# Altium schematic sheet Gate Driver.SchDoc
size B; SheetNumber: 1; SheetTotal: 1
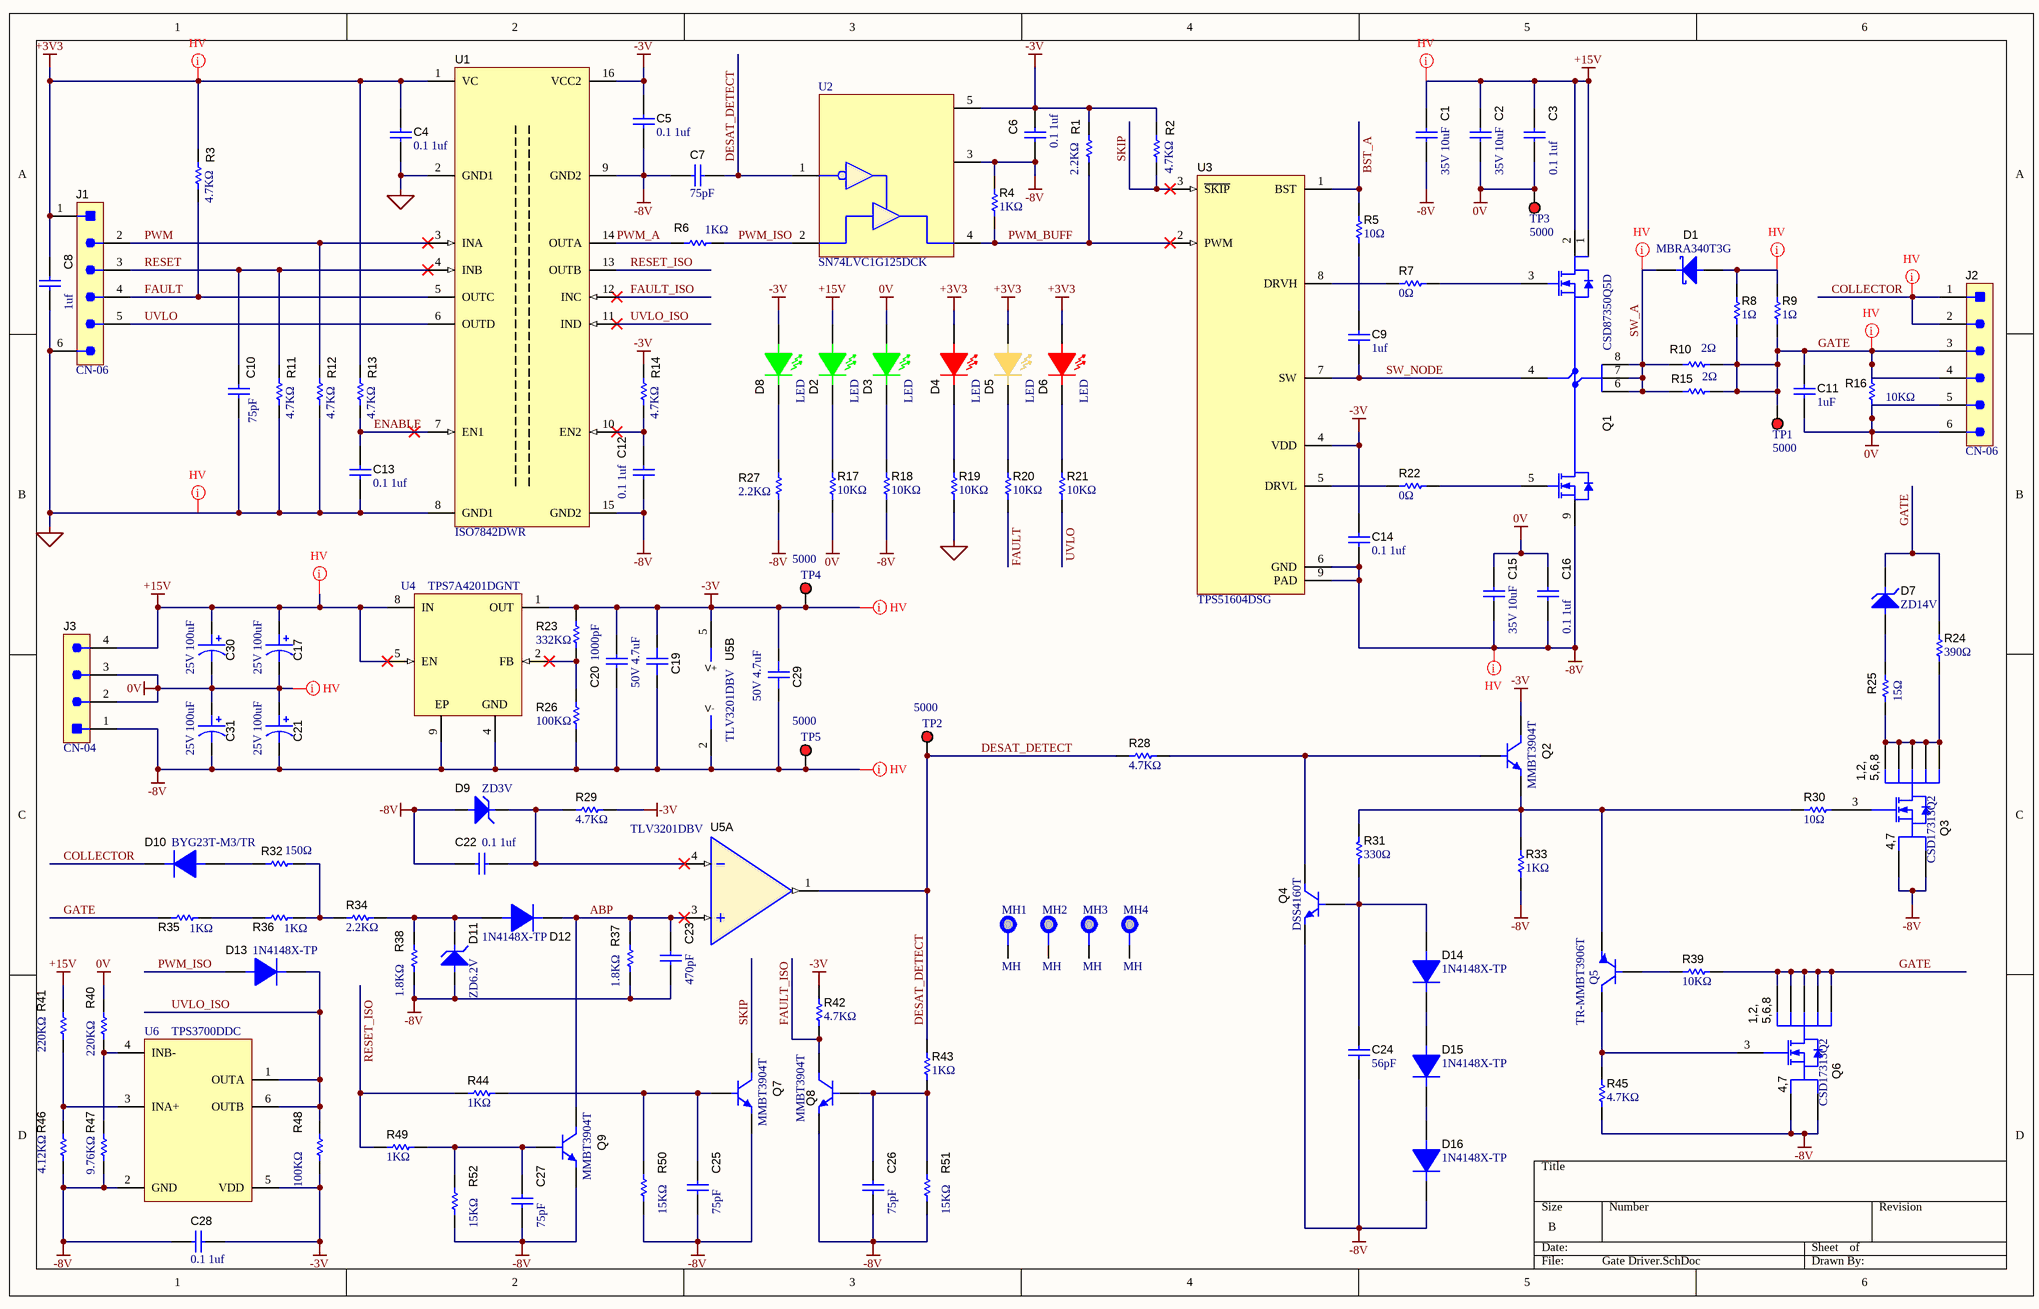
[diagram p0: Gate Driver.SchDoc]

## Parts
C1  35V 10uF  [1206]
C2  35V 10uF  [1206]
C3  0.1 1uf  [1206]
C4  0.1 1uf  [0603]
C5  0.1 1uf  [0603]
C6  0.1 1uf  [0603]
C7  75pF  [0603]
C8  1uf  [0603]
C9  1uf  [1206]
C10  75pF  [0603]
C11  1uF  [0603_2]
C12  0.1 1uf  [0603]
C13  0.1 1uf  [0603]
C14  0.1 1uf  [0603]
C15  35V 10uF  [1206]
C16  0.1 1uf  [1206]
C17  25V 100uF  [SM_RADIAL_6.3BMM]
C19  50V 4.7uF  [1206_190]
C20  1000pF  [0603]
C21  25V 100uF  [SM_RADIAL_6.3BMM]
C22  0.1 1uf  [0603]
C23  470pF  [0603]
C24  56pF  [0603]
C25  75pF  [0603]
C26  75pF  [0603]
C27  75pF  [0603]
C28  0.1 1uf  [0603]
C29  50V 4.7uF  [1206_190]
C30  25V 100uF  [SM_RADIAL_6.3BMM]
C31  25V 100uF  [SM_RADIAL_6.3BMM]
D1  MBRA340T3G  [SMA]
D2  LED  [WL-SMCW_GREEN]
D3  LED  [WL-SMCW_GREEN]
D4  LED  [WL-SMCW_RED]
D5  LED  [WL-SMCW_YELLOW]
D6  LED  [WL-SMCW_RED]
D7  ZD14V  [SMA]
D8  LED  [WL-SMCW_GREEN]
D9  ZD3V  [SOD-123]
D10  BYG23T-M3/TR  [SMA]
D11  ZD6.2V  [sod-323]
D12  1N4148X-TP  [SOD-523]
D13  1N4148X-TP  [SOD-523]
D14  1N4148X-TP  [SOD-523]
D15  1N4148X-TP  [SOD-523]
D16  1N4148X-TP  [SOD-523]
J1  CN-06  [Molex_22-23-2061]
J2  CN-06  [Molex_22-23-2061]
J3  CN-04  [CONN_22112042]
MH1  MH  [Mounting Hole]
MH2  MH  [Mounting Hole]
MH3  MH  [Mounting Hole]
MH4  MH  [Mounting Hole]
Q1  CSD87350Q5D  [DQY0008A]
Q2  MMBT3904T  [SOT-523_2]
Q3  CSD17313Q2  [TRANS_CSD17313Q2]
Q4  DSS4160T  [SOT-23]
Q5  TR-MMBT3906T  [SOT-523_2]
Q6  CSD17313Q2  [TRANS_CSD17313Q2]
Q7  MMBT3904T  [SOT-523_2]
Q8  MMBT3904T  [SOT-523_2]
Q9  MMBT3904T  [SOT-523_2]
R1  2.2KΩ  [0603]
R2  4.7KΩ  [0603]
R3  4.7KΩ  [0603]
R4  1KΩ  [0603]
R5  10Ω  [1206]
R6  1KΩ  [0603]
R7  0Ω  [0603]
R8  1Ω  [2512]
R9  1Ω  [2512]
R10  2Ω  [2512]
R11  4.7KΩ  [0603]
R12  4.7KΩ  [0603]
R13  4.7KΩ  [0603]
R14  4.7KΩ  [0603]
R15  2Ω  [2512]
R16  10KΩ  [0603]
R17  10KΩ  [0603]
R18  10KΩ  [0603]
R19  10KΩ  [0603]
R20  10KΩ  [0603]
R21  10KΩ  [0603]
R22  0Ω  [0603]
R23  332KΩ  [0603]
R24  390Ω  [0603]
R25  15Ω  [0603]
R26  100KΩ  [0603]
R27  2.2KΩ  [0603]
R28  4.7KΩ  [0603]
R29  4.7KΩ  [0603]
R30  10Ω  [0603]
R31  330Ω  [0603]
R32  150Ω  [0603]
R33  1KΩ  [0603]
R34  2.2KΩ  [0603]
R35  1KΩ  [0603]
R36  1KΩ  [0603]
R37  1.8KΩ  [0603]
R38  1.8KΩ  [0603]
R39  10KΩ  [0603]
R40  220KΩ  [0603]
R41  220KΩ  [0603]
R42  4.7KΩ  [0603]
R43  1KΩ  [0603]
R44  1KΩ  [0603]
R45  4.7KΩ  [0603]
R46  4.12KΩ  [0603]
R47  9.76KΩ  [0603]
R48  100KΩ  [0603]
R49  1KΩ  [0603]
R50  15KΩ  [0603]
R51  15KΩ  [0603]
R52  15KΩ  [0603]
TP1  5000  [Keystone5000]
TP2  5000  [Keystone5000]
TP3  5000  [Keystone5000]
TP4  5000  [Keystone5000]
TP5  5000  [Keystone5000]
U1  ISO7842DWR  [DW0016B_N]
U2  SN74LVC1G125DCK  [DBV0005A_L]
U3  TPS51604DSG  [DSG0008A]
U4  TPS7A4201DGNT  [DGN0008B_L]
U5  TLV3201DBV  [DBV0005A_N]  (parts A,B of 2)
U6  TPS3700DDC  [SOT23-6]

## Nets
0V: C2.2 C3.2 C11.2 C15.1 C16.1 C17.2(-) C21.1(+) C30.2(-) C31.1(+) D3.2(A) J2.5 J2.6 J3.2 J3.3 R16.1 R17.1 R40.2 TP3.1
+3V3: C4.1 C8.1 D4.2(A) D5.2(A) D6.2(A) J1.1 R3.2 R13.2 U1.1(VC)
+15V: C1.1 C2.1 C3.1 C17.1(+) C30.1(+) D2.2(A) J3.4 Q1.1(VIN) Q1.2(VIN) R41.2 U4.5(EN) U4.8(IN)
-3V: C5.1 C6.2 C14.1 C19.1 C20.1 C28.1 C29.1 D8.2(A) Q2.3(C) R1.2 R2.2 R14.2 R23.2 R29.2 R42.2 R48.1 TP4.1 U1.16(VCC2) U2.5(VCC) U3.4(VDD) U4.1(OUT) U5.5(V+) U6.5(VDD)
-8V: C1.2 C5.2 C6.1 C7.2 C12.2 C14.2 C15.2 C16.2 C19.2 C20.2 C21.2(-) C22.1 C23.2 C24.2 C25.2 C26.2 C27.2 C28.2 C29.2 C31.2(-) D9.2(A) D11.2(A) D16.1(K) J3.1 Q1.9(PGND) Q3.4(S) Q3.7(S) Q4.2(E) Q6.4(S) Q6.7(S) Q7.2(E) Q8.2(E) Q9.2(E) R4.2 R18.1 R26.1 R27.1 R33.1 R37.1 R38.1 R45.1 R46.1 R47.1 R50.1 R51.1 R52.1 TP5.1 U1.9(GND2) U1.15(GND2) U2.3(GND) U3.6(GND) U3.9(PAD) U4.4(GND) U4.9(EP) U5.2(V-) U6.2(GND)
AGND: C4.2 C8.2 C10.2 C13.2 J1.6 R11.1 R12.1 R19.1 U1.2(GND1) U1.8(GND1)
ABP: C23.1 D12.1(K) Q9.3(C) R37.2 U5.3(IN+)
BST_A: R5.2 U3.1(BST)
COLLECTOR: D10.1(K) J2.1 J2.2
DESAT_DETECT: C7.1 R28.1 R43.2 TP2.1 U2.1(~OE) U5.1(OUT)
ENABLE: C13.1 R13.1 U1.7(EN1)
FAULT: J1.4 R3.1 R20.1 U1.5(OUTC)
FAULT_ISO: Q8.3(C) R42.1 U1.12(INC)
GATE: C11.1 D7.1(K) J2.3 J2.4 Q6.1(D) Q6.2(D) Q6.5(D) Q6.6(D) Q6.8(D) R8.1 R9.1 R10.2 R15.2 R16.2 R24.2 R35.1 R39.1 TP1.1
PWM: J1.2 R12.2 U1.3(INA)
PWM_A: R6.2 U1.14(OUTA)
PWM_BUFF: R1.1 R4.1 U2.4(Y) U3.2(PWM)
PWM_ISO: D13.2(A) R6.1 U2.2(A)
RESET: C10.1 J1.3 R11.2 U1.4(INB)
RESET_ISO: R44.1 R49.1 U1.13(OUTB)
SKIP: Q7.3(C) R2.1 U3.3(~{SKIP})
SW_A: D1.1(K) Q1.6(VSW) Q1.7(VSW) Q1.8(VSW) R10.1 R15.1
SW_NODE: C9.2 Q1.4(TGR) U3.7(SW)
UVLO: J1.5 R21.1 U1.6(OUTD)
UVLO_ISO: D13.1(K) R48.2 U1.11(IND) U6.1(OUTA) U6.6(OUTB)
NetC9_1: C9.1 R5.1
NetC12_1: C12.1 R14.1 U1.10(EN2)
NetC22_2: C22.2 D9.1(K) R29.1 U5.4(IN-)
NetC24_1: C24.1 D14.2(A) Q4.1(B) R31.1
NetC25_1: C25.1 Q7.1(B) R44.2 R50.2
NetC26_1: C26.1 Q8.1(B) R43.1 R51.2
NetC27_1: C27.1 Q9.1(B) R49.2 R52.2
NetD1_2: D1.2(A) R8.2 R9.2
NetD2_1: D2.1(K) R17.2
NetD3_1: D3.1(K) R18.2
NetD4_1: D4.1(K) R19.2
NetD5_1: D5.1(K) R20.2
NetD6_1: D6.1(K) R21.2
NetD7_2: D7.2(A) R25.2
NetD8_1: D8.1(K) R27.2
NetD10_2: D10.2(A) R32.1
NetD11_1: D11.1(K) D12.2(A) R34.2 R38.2
NetD14_1: D14.1(K) D15.2(A)
NetD15_1: D15.1(K) D16.2(A)
NetQ1_3: Q1.3(TG) R7.2
NetQ1_5: Q1.5(BG) R22.2
NetQ2_1: Q2.1(B) Q4.3(C) R28.2
NetQ2_2: Q2.2(E) Q5.2(E) R30.1 R31.2 R33.2
NetQ3_1: Q3.1(D) Q3.2(D) Q3.5(D) Q3.6(D) Q3.8(D) R24.1 R25.1
NetQ3_3: Q3.3(G) R30.2
NetQ5_1: Q5.1(B) R39.2
NetQ5_3: Q5.3(C) Q6.3(G) R45.2
NetR7_1: R7.1 U3.8(DRVH)
NetR22_1: R22.1 U3.5(DRVL)
NetR23_1: R23.1 R26.2 U4.2(FB)
NetR32_2: R32.2 R34.1 R36.2
NetR35_2: R35.2 R36.1
NetR40_1: R40.1 R47.2 U6.4(INB-)
NetR41_1: R41.1 R46.2 U6.3(INA+)

Not connected (* = marked no-connect by the designer): MH1 1; MH2 1; MH3 1; MH4 1

## Layout directives
net class HV: 0V, +3V3, +15V, -3V, -8V, AGND, COLLECTOR, GATE, NetD1_2, SW_A

## Notes on the sheet
- (in symbol CSD17313Q2) 1,2,; 5,6,8; 4,7

## Library data of the parts
C1 C2 C15 = GMK316AB7106KL: CAP, CERM, 10 µF, 35 V, +/- 10%, X7R, 1206; Manufacturer: Taiyo Yuden; Polarized: N; CompType: Capacitor; U/M: EA; Cap_F: 0.00001; Tolerance_%: 10; Value1: Unknown; VDC_V: 35; TaMin_C: -55; TaMax_C: 125; ValueDisplayed: 10µF; SymbolVersion: 2008-07-09; Value: 10uF; PartNumber: GMK316AB7106KL; PackageReference: 1206; RoHS: Y; Value2: 35V; MountType: SMT; Technology: Ceramic; TempCo: X7R; Cap_Case: 1206; Published: 2008-06-19; Publisher: Texas Instruments; LatestRevisionDate: 2015-04-23; ComponentLink1Description: Datasheet link; ComponentLink1URL: http://www.yuden.co.jp/productdata/catalog/en/mlcc101_e.pdf; Supplier 1: Digi-Key; Supplier Part Number 1: 587-3007-1-ND; Supplier 2: Mouser; Supplier Part Number 2: 963-GMK316AB7106KL; Supplier 3: Farnell; Supplier Part Number 3: 2309034
C3 C16 = 06035C104KAT2A: CAP, CERM, 0.1 µF, 50 V, +/- 10%, X7R, 0603; Manufacturer: AVX; Polarized: N; CompType: Capacitor; Value: 50V 0.1uF; U/M: EA; Cap_F: 0.0000001; Tolerance_%: 10; Value1: Unknown; VDC_V: 50; Value2: 50V; TaMin_C: -55; TaMax_C: 125; Cap_Case: 0603; SymbolVersion: 2008-07-09; PartNumber: 06035C104KAT2A; PackageReference: 0603; RoHS: Y; MountType: SMT; Technology: Ceramic; TempCo: X7R; Published: 2008-06-19; Publisher: Texas Instruments; LatestRevisionDate: 2015-04-23; ComponentLink1Description: Datasheet link; ComponentLink1URL: http://www.avx.com/docs/Catalogs/cx7r.pdf; Supplier 1: Digi-Key; Supplier Part Number 1: 478-5052-1-ND; Supplier 2: Mouser; Supplier Part Number 2: 581-06035C104KAT2A; Supplier 3: Farnell; Supplier Part Number 3: 1301804
C4-C6 C8 C12-C14 C22 C28 = 06035C104KAT2A: CAP, CERM, 0.1 µF, 50 V, +/- 10%, X7R, 0603; Manufacturer: AVX; Polarized: N; CompType: Capacitor; Value: 50V 0.1uF; U/M: EA; Cap_F: 0.0000001; Tolerance_%: 10; Value1: Unknown; VDC_V: 50; Value2: 50V; TaMin_C: -55; TaMax_C: 125; SymbolVersion: 2008-07-09; PartNumber: 06035C104KAT2A; PackageReference: 0603; RoHS: Y; MountType: SMT; Technology: Ceramic; TempCo: X7R; Cap_Case: 0603; Published: 2008-06-19; Publisher: Texas Instruments; LatestRevisionDate: 2015-04-23; ComponentLink1Description: Datasheet link; ComponentLink1URL: http://www.avx.com/docs/Catalogs/cx7r.pdf; Supplier 1: Digi-Key; Supplier Part Number 1: 478-5052-1-ND; Supplier 2: Mouser; Supplier Part Number 2: 581-06035C104KAT2A; Supplier 3: Farnell; Supplier Part Number 3: 1301804
C7 C10 C25-C27 = GRM1885C1H750JA01D: CAP, CERM, 75 pF, 50 V, +/- 5%, C0G/NP0, 0603; Manufacturer: MuRata; Polarized: N; CompType: Capacitor; U/M: EA; Cap_F: 0.000000000075; Tolerance_%: 5; Value1: Unknown; VDC_V: 50; Value2: 50V; TaMin_C: -55; TaMax_C: 125; SymbolVersion: 2008-07-09; Value: 75pF; PartNumber: GRM1885C1H750JA01D; PackageReference: 0603; RoHS: Y; MountType: SMT; Technology: Ceramic; TempCo: C0G/NP0; Cap_Case: 0603; Published: 2008-06-19; Publisher: Texas Instruments; LatestRevisionDate: 2015-06-13; ComponentLink1Description: Datasheet link; ComponentLink1URL: http://search.murata.co.jp/Ceramy/PnsearchViewAction.do?HnOFG=ON&HnNFG=ON&SEL_CNT=50&sLang=en&sKey=GRM1885C1H750JA01D&x=9&y=9&search=startwith; Supplier 1: Digi-Key; Supplier Part Number 1: 490-1424-1-ND; Supplier 2: Mouser; Supplier Part Number 2: 81-GRM1885C1H750JA; Supplier 3: Farnell; Supplier Part Number 3: 1690399; ValueDisplayed: 75pF
C9 = 08055C105KAT2A: CAP, CERM, 1 µF, 50 V, +/- 10%, X7R, 0805; Manufacturer: AVX; Polarized: N; CompType: Capacitor; Value: 50V 1uF; U/M: EA; Cap_F: 0.000001; Tolerance_%: 10; Value1: Unknown; VDC_V: 50; Value2: 50V; TaMin_C: -55; TaMax_C: 125; Cap_Case: 0805; SymbolVersion: 2008-07-09; PartNumber: 08055C105KAT2A; PackageReference: 0805; RoHS: Y; MountType: SMT; Technology: Ceramic; TempCo: X7R; Published: 2008-06-19; Publisher: Texas Instruments; LatestRevisionDate: 2015-05-02; ComponentLink1Description: Datasheet link; ComponentLink1URL: http://www.avx.com/docs/Catalogs/cx7r.pdf; Supplier 1: Digi-Key; Supplier Part Number 1: 478-7956-1-ND; Supplier 2: Mouser; Supplier Part Number 2: 581-08055C105KAT2A; Supplier 3: Farnell; Supplier Part Number 3: 2094043
C11 = 08055C105KAT2A_1: DNP; Manufacturer: AVX; Polarized: N; CompType: Capacitor; U/M: EA; Cap_F: 0.000001; Tolerance_%: 10; Value1: Unknown; VDC_V: 50; Value2: 50V; TempCo: X7R; TaMin_C: -55; TaMax_C: 125; Cap_Case: 0805; ValueDisplayed: 1µF; SymbolVersion: 2008-07-09; Value: 1uF; PartNumber: DNP; PackageReference: 0805; RoHS: Y; MountType: SMT; Technology: Ceramic; Published: 2008-06-19; Publisher: Texas Instruments; LatestRevisionDate: 2015-05-02; ComponentLink1Description: Datasheet link; ComponentLink1URL: http://www.avx.com/docs/Catalogs/cx7r.pdf; Supplier 1: Digi-Key; Supplier Part Number 1: 478-7956-1-ND; Supplier 2: Mouser; Supplier Part Number 2: 581-08055C105KAT2A; Supplier 3: Farnell; Supplier Part Number 3: 2094043
C17 C21 C30 C31 = UUD1E101MCL1GS: CAP, AL, 100 µF, 25 V, +/- 20%, 0.34 ohm, SMD; Manufacturer: Nichicon; Polarized: Y; CompType: Capacitor; Value: 100V 100uF; U/M: EA; Cap_F: 0.0001; Tolerance_%: 20; VDC_V: 25; ESR_ohm: 0.34; IRMS_A: 0.28; TaMin_C: -55; TaMax_C: 105; Cap_Case: 6.3x7.7; SymbolVersion: 2008-07-09; PartNumber: UUD1E101MCL1GS; PackageReference: 6.3x7.7; RoHS: Y; Value1: 0.34 ohm; Value2: 25V; MountType: SMT; Technology: AL; Series: uD; Publisher: Texas Instruments; LatestRevisionDate: 2015-04-24; ComponentLink1Description: Datasheet link; ComponentLink1URL: http://products.nichicon.co.jp/en/pdf/XJA043/e-ud.pdf; Supplier 1: Digi-Key; Supplier Part Number 1: 493-2276-1-ND; Supplier 2: Mouser; Supplier Part Number 2: 647-UUD1E101MCL; Supplier 3: Farnell; Supplier Part Number 3: 1823571
C19 C29 = UMK316AB7475KL-T: CAP, CERM, 4.7 µF, 50 V, +/- 10%, X7R, 1206_190; Manufacturer: Taiyo Yuden; Polarized: N; CompType: Capacitor; U/M: EA; Cap_F: 0.0000047; Tolerance_%: 10; Value1: Unknown; VDC_V: 50; TaMin_C: -55; TaMax_C: 125; Cap_Case: 1206; SymbolVersion: 2008-07-09; Value: 4.7uF; PartNumber: UMK316AB7475KL-T; PackageReference: 1206_190; RoHS: Y; Value2: 50V; MountType: SMT; Technology: Ceramic; TempCo: X7R; Published: 2008-06-19; Publisher: Texas Instruments; LatestRevisionDate: 2015-05-02; ComponentLink1Description: Datasheet link; ComponentLink1URL: http://www.yuden.co.jp/productdata/catalog/en/mlcc_all_e.pdf; Supplier 1: Digi-Key; Supplier Part Number 1: 587-2994-2-ND; Supplier 2: Mouser; Supplier Part Number 2: 963-UMK316AB7475KL-T; Supplier 3: Farnell; Supplier Part Number 3: 2371497
C20 = 06035A102KAT2A: CAP, CERM, 1000 pF, 50 V, +/- 10%, C0G/NP0, 0603; Manufacturer: AVX; Polarized: N; CompType: Capacitor; Value: 50V 1000pF; U/M: EA; Cap_F: 0.000000001; Tolerance_%: 10; ESR_ohm: 0.048; Value1: 0.048 ohm; VDC_V: 50; Value2: 50V; TaMin_C: -55; TaMax_C: 125; SymbolVersion: 2008-07-09; PartNumber: 06035A102KAT2A; PackageReference: 0603; RoHS: Y; MountType: SMT; Technology: Ceramic; TempCo: C0G/NP0; Cap_Case: 0603; Published: 2008-06-19; Publisher: Texas Instruments; LatestRevisionDate: 2015-04-23; ComponentLink1Description: Datasheet link; ComponentLink1URL: http://www.avx.com/docs/masterpubs/smccp.pdf; Supplier 1: Digi-Key; Supplier Part Number 1: 478-3718-1-ND; Supplier 2: Mouser; Supplier Part Number 2: 581-06035A102KAT2A; Supplier 3: Farnell; Supplier Part Number 3: 1582693
C23 = 06035A471JAT2A: CAP, CERM, 470 pF, 50 V, +/- 5%, C0G/NP0, 0603; Manufacturer: AVX; Polarized: N; CompType: Capacitor; Value: 50V 470pF; U/M: EA; Cap_F: 0.00000000047; Tolerance_%: 5; ESR_ohm: 0.063; Value1: 0.063 ohm; VDC_V: 50; Value2: 50V; TaMin_C: -55; TaMax_C: 125; SymbolVersion: 2008-07-09; PartNumber: 06035A471JAT2A; PackageReference: 0603; RoHS: Y; MountType: SMT; Technology: Ceramic; TempCo: C0G/NP0; Cap_Case: 0603; Published: 2008-06-19; Publisher: Texas Instruments; LatestRevisionDate: 2015-06-13; ComponentLink1Description: Datasheet link; ComponentLink1URL: http://www.avx.com/docs/masterpubs/smccp.pdf; Supplier 1: Digi-Key; Supplier Part Number 1: 478-1183-1-ND; Supplier 2: Mouser; Supplier Part Number 2: 581-06035A471J; Supplier 3: Farnell; Supplier Part Number 3: 316672
C24 = 06035A560FAT2A: CAP, CERM, 56 pF, 50 V, +/- 1%, C0G/NP0, 0603; Manufacturer: AVX; Polarized: N; CompType: Capacitor; Value: 50V 56pF; U/M: EA; Cap_F: 0.000000000056; Tolerance_%: 1; Value1: Unknown; VDC_V: 50; Value2: 50V; TaMin_C: -55; TaMax_C: 125; SymbolVersion: 2008-07-09; PartNumber: 06035A560FAT2A; PackageReference: 0603; RoHS: Y; MountType: SMT; Technology: Ceramic; TempCo: C0G/NP0; Cap_Case: 0603; Published: 2008-06-19; Publisher: Texas Instruments; LatestRevisionDate: 2015-06-13; ComponentLink1Description: Datasheet link; ComponentLink1URL: http://www.avx.com/docs/Catalogs/ccog.pdf; Supplier 1: Digi-Key; Supplier Part Number 1: 478-7922-1-ND; Supplier 2: Mouser; Supplier Part Number 2: 581-06035A560FAT2A; Supplier 3: Newark; Supplier Part Number 3: 11J1247
D1 = MBRA340T3G: Diode, Schottky, 40 V, 3 A, SMA; Manufacturer: ON Semiconductor; U/M: EA; Vf_V: 0.415; Value1: 3A; Value2: 0.415V; Io_A: 3; Vr_V: 40; RJC_CperW: 15; CompType: Diode; SymbolVersion: 2008-12-08; PartNumber: MBRA340T3G; PackageReference: SMA; Value: Schottky; MountType: SMT; Type: Schottky; Published: 2008-06-26; Publisher: Texas Instruments; LatestRevisionDate: 2015-04-26; ComponentLink1Description: Datasheet link; ComponentLink1URL: http://www.onsemi.com/pub_link/Collateral/MBRA340T3-D.PDF; Supplier 1: Farnell; Supplier Part Number 1: 1431078
D2 D3 D8 = 150060GS75000: LED, Green, SMD; Manufacturer: Wurth Elektronik; Type: InGaN; Vf_V: 3.2; Value2: 3.2V; Io_A: 0.02; Tjmax_C: 85; Value1: W; Angle: 140; U/M: EA; CompType: LED; PartNumber: 150060GS75000; SymbolVersion: 2008-11-06; MountType: SMT; RoHS: Y; PackageReference: LED_0603; Color: Green; Published: 2008-07-11; Publisher: Texas Instruments; ComponentLink1URL: http://katalog.we-online.de/led/datasheet/150060GS75000.pdf; ComponentLink1Description: Datasheet link; LatestRevisionDate: 2015-04-23; Supplier 1: Digi-Key; Supplier Part Number 1: 732-4971-1-ND; Supplier 2: Mouser; Supplier Part Number 2: 710-150060GS75000; Supplier 3: Farnell; Supplier Part Number 3: 2322070; VALUE: Green
D4 D6 = 150060SS75000: LED, Super Red, SMD; Manufacturer: Wurth Elektronik; Type: AlInGaP; Vf_V: 1.9; Value2: 1.9V; Io_A: 0.02; Value1: W; U/M: EA; CompType: LED; PartNumber: 150060SS75000; SymbolVersion: 2008-11-06; MountType: SMT; RoHS: Y; PackageReference: LED_0603; Color: super red; Published: 2008-07-11; Publisher: Texas Instruments; ComponentLink1URL: http://katalog.we-online.de/led/datasheet/150060SS75000.pdf; ComponentLink1Description: Datasheet link; LatestRevisionDate: 2015-04-23; Supplier 1: Digi-Key; Supplier Part Number 1: 732-4979-1-ND; VALUE: Super Red
D5 = 150060YS75000: LED, Yellow, SMD; Manufacturer: Wurth Elektronik; Type: AlInGaP; Vf_V: 2; Value2: 2V; Io_A: 0.02; Value1: W; U/M: EA; CompType: LED; PartNumber: 150060YS75000; SymbolVersion: 2008-11-06; MountType: SMT; RoHS: Y; PackageReference: LED_0603; Color: yellow; Published: 2008-07-11; Publisher: Texas Instruments; ComponentLink1URL: http://katalog.we-online.de/led/datasheet/150060YS75000.pdf; ComponentLink1Description: Datasheet link; LatestRevisionDate: 2015-04-23; Supplier 1: Digi-Key; Supplier Part Number 1: 732-4981-1-ND; VALUE: Yellow
D7 = 3SMAJ5926B: Diode, Zener, 11 V, DO-214AC; PartNumber: SMAJ14CA; Manufacturer: Littelfuse Inc.; SymbolCreator: x0199378; SymbolVersion: 2015-06-17; CompType: Zener; MountType: SMT; RoHS: Y; ComponentLink1Description: Datasheet link; ComponentLink1URL: http://www.mccsemi.com/up_pdf/3SMAJ5913B~3SMAJ5943B%28DO-214AC%29.pdf
D9 = MMSZ4683-V: Diode, Zener, 3 V, 500 mW, SOD-123; Manufacturer: Vishay-Semiconductor; SymbolCreator: a0412235; U/M: EA; Power_W: 0.5; Vz_V: 3; Value1: 0.5W; RJA_CperW: 67; SymbolVersion: 2010-08-25; PartNumber: MMSZ4683-V; PackageReference: SOD-123; CompType: Zener; Vr_V: N/A; MountType: SMT; RoHS: Y; ComponentLink1Description: Datasheet link; ComponentLink1URL: http://www.vishay.com/docs/85773/mmsz4681.pdf; Published: 2008-10-08; Publisher: Texas Instruments; LatestRevisionDate: 2015-03-27; LatestRevisionNote: Updated Supplier Data; Supplier 1: Newark; Supplier Part Number 1: 69R4754; Value: ZD3V
D10 = BYG23T-M3/TR: Diode, Ultrafast, 1300 V, 1 A, SMA; Manufacturer: Vishay-Semiconductor; U/M: EA; Vf_V: 1.9; Value1: 1A; Value2: 1.9V; Io_A: 1; Vr_V: 1300; TJmax_C: 150; SymbolVersion: 2008-12-08; PartNumber: BYG23T-M3/TR; PackageReference: SMA; CompType: Diode; Value: Ultrafast; MountType: SMT; Type: Ultrafast; RoHS: Y; Published: 2008-06-26; Publisher: Texas Instruments; LatestRevisionDate: 2015-06-16; ComponentLink1Description: Datasheet link; ComponentLink1URL: http://www.vishay.com/docs/89429/byg23t.pdf; Supplier 1: Digi-Key; Supplier Part Number 1: BYG23T-M3/CT-ND; Supplier 2: Mouser; Supplier Part Number 2: 78-BYG23T-M3/TR; Supplier 3: Farnell; Supplier Part Number 3: 2115184
D11 = MMSZ5234BS-7-F: Diode, Zener, 6.2 V, 200 mW, SOD-323; Manufacturer: Diodes Inc.; SymbolCreator: a0412235; U/M: EA; Power_W: 0.2; Vz_V: 6.2; Value1: 0.2W; RJA_CperW: 350; SymbolVersion: 2010-08-25; PartNumber: MMSZ5234BS-7-F; PackageReference: SOD-323; CompType: Zener; Vr_V: N/A; MountType: SMT; RoHS: Y; ComponentLink1Description: Datasheet link; ComponentLink1URL: http://www.diodes.com/datasheets/ds31038.pdf; Published: 2008-10-08; Publisher: Texas Instruments; LatestRevisionDate: 2015-06-15; LatestRevisionNote: Updated Supplier Data; Supplier 1: Digi-Key; Supplier Part Number 1: MMSZ5234BS-FDICT-ND; Supplier 2: Mouser; Supplier Part Number 2: 621-MMSZ5234BS-F; Value: ZD6.2V
D12-D16 = 1N4148X-TP: Diode, Switching, 75 V, 0.3 A, SOD-523; Manufacturer: Micro Commercial Components; U/M: EA; Vf_V: 1.25; Value: 75V; Value1: 0.3A; Value2: 1.25V; Io_A: 0.3; Vr_V: 75; TJmax_C: 150; SymbolVersion: 2008-12-08; PartNumber: 1N4148X-TP; PackageReference: SOD-523; CompType: Diode; MountType: SMT; Type: Switching; RoHS: Y; Published: 2008-06-26; Publisher: Texas Instruments; LatestRevisionDate: 2015-06-16; ComponentLink1Description: Datasheet link; ComponentLink1URL: http://www.mccsemi.com/up_pdf/1N4148X(SOD-523).PDF; Supplier 1: Digi-Key; Supplier Part Number 1: 1N4148XTPMSCT-ND; Supplier 2: Mouser; Supplier Part Number 2: 833-1N4148X-TP; Supplier 3: Newark; Supplier Part Number 3: 69R6666
J1 = 22-23-2061_1: Header, 2.54 mm, 6x1, Tin, TH; Manufacturer: Molex; SymbolCreator: a0412235; U/M: EA; SymbolVersion: 2013-08-30; PartNumber: 22-23-2061; PackageReference: Header, 2.54mm, 6x1, TH; ClassName: Header; CompType: Header; RoHS: Y; MountType: TH; ComponentLink1Description: Datasheet Link; ComponentLink1URL: http://www.molex.com/pdm_docs/sd/022232061_sd.pdf; Value: CN-06; Publisher: Texas Instruments; LatestRevisionDate: 2015-04-17; Supplier 1: Digi-Key; Supplier Part Number 1: WM4204-ND; Supplier 2: Mouser; Supplier Part Number 2: 538-22-23-2061; Supplier 3: Farnell; Supplier Part Number 3: 1462922
J2 = 22-23-2061: Header, 2.54 mm, 6x1, Tin, TH; Manufacturer: Molex; SymbolCreator: a0412235; U/M: EA; SymbolVersion: 2013-08-30; PartNumber: 22-23-2061; PackageReference: Header, 2.54mm, 6x1, TH; ClassName: Header; CompType: Header; RoHS: Y; MountType: TH; ComponentLink1Description: Datasheet Link; ComponentLink1URL: http://www.molex.com/pdm_docs/sd/022232061_sd.pdf; Value: CN-06; Publisher: Texas Instruments; LatestRevisionDate: 2015-04-17; Supplier 1: Digi-Key; Supplier Part Number 1: WM4204-ND; Supplier 2: Mouser; Supplier Part Number 2: 538-22-23-2061; Supplier 3: Farnell; Supplier Part Number 3: 1462922
J3 = 0022112042: Header (friction lock), 100mil, 4x1, Gold, TH; Manufacturer: Molex; SymbolCreator: a0412235; U/M: EA; SymbolVersion: 2013-08-30; PartNumber: 0022112042; PackageReference: Header 4x1 keyed; CompType: Header; RoHS: Y; MountType: TH; ComponentLink1Description: Datasheet Link; ComponentLink1URL: http://www.molex.com/pdm_docs/sd/022112042_sd.pdf; Publisher: Texas Instruments; LatestRevisionDate: 2015-04-17; Supplier 1: Digi-Key; Supplier Part Number 1: WM2702-ND
MH1-MH4 = Mounting Hole
Q1 = CSD87350Q5D: Synchronous Buck NexFET Power Block, DQY0008A; PartNumber: CSD87353Q5D; Manufacturer: Texas Instruments; SymbolCreator: a0799628; CompType: IC; U/M: EA; Value: SYN MOSFET; SymbolVersion: 2014-11-03; PackageReference: DQY0008A; MountType: SMT; ComponentLink1Description: Datasheet Link; ComponentLink1URL: http://www.ti.com/lit/ds/symlink/csd87353q5d.pdf; RoHS: Y; Publisher: Texas Instruments; LatestRevisionDate: 2015-05-04; Alternate Manufacturer: Texas Instruments
Q2 Q7-Q9 = MMBT3904T-7-F, Diodes Inc.: Transistor, NPN, 40 V, 0.2 A, SOT-523; CompType: BJT; PNP: 0; NPN: 1; Vceo_V: 40; Vcesat1_V: 0.2; Value1: 0.2 A; HfeMax: 300; TaMin_C: -55; TaMax_C: 150; U/M: EA; SymbolVersion: 2008-07-31; PartNumber: MMBT3904T-7-F; Manufacturer: Diodes Inc.; PackageReference: SOT-523; RoHS: Y; Value: NPN; IcRated_A: 0.2; Value2: 300; Published: 2008-07-31; LatestRevisionDate: 2015-04-22; Publisher: Texas Instruments; ComponentLink1Description: Datasheet link; ComponentLink1URL: http://www.diodes.com/datasheets/ds30270.pdf; Supplier 1: Digi-Key; Supplier Part Number 1: MMBT3904T-FDICT-ND; Supplier 2: Mouser; Supplier Part Number 2: 621-MMBT3904T-F; Supplier 3: Farnell; Supplier Part Number 3: 1773615; MountType: SMT
Q3 Q6 = CSD17313Q2: MOSFET, N-CH, 30 V, 5 A, SON 2x2mm; Manufacturer: Texas Instruments; Alternate Manufacturer: None; U/M: EA; ChType: N; Value: N-MOSFET; VdsMax_V: 30; Value1: 0.026 ohm; Rdson45_ohm: 0.026; Value2: 2.1 nC; QgTyp_nC: 2.1; Vgs_V: 10; IdsMax_A: 5; SymbolVersion: 2011-11-14; CompType: MOSFET; PartNumber: CSD17313Q2; PackageReference: SON 2x2mm; RoHS: Y; MountType: SMT; Published: 2008-06-19; Publisher: Texas Instruments; LatestRevisionDate: 2015-04-24; LatestRevisionNote: Added parts.; ComponentLink1Description: Datasheet link; ComponentLink1URL: http://www.ti.com/lit/ds/symlink/csd17313q2.pdf; Supplier 1: Digi-Key; Supplier Part Number 1: 296-27233-1-ND; Supplier 2: Mouser; Supplier Part Number 2: 595-CSD17313Q2; Supplier 3: Farnell; Supplier Part Number 3: 1863737
Q4 = DSS4160T: TRANSISTOR, NPN, 60V, 1A, SOT23-3; Manufacturer: DIODES INCORPORATED; CompType: Bipolar Transistor; SymbolCreator: x0199378; SymbolVersion: 2015-06-17; PartNumber: DSS4160T; RoHS: Y; MountType: SMT; ComponentLink1Description: Datasheet Link; ComponentLink1URL: http://www.diodes.com/datasheets/DSS4160T.pdf; Value: NPN
Q5 = TR-MMBT3906T-7-F: Bipolar, PNP, -40V, -200mA, -200mW; Manufacturer: Diodes; Area: 11904; ComponentLink1URL: \\vette02\pmp_pcb\pcad_pdf's\MMBT3906T.pdf; SymbolVersion: 10/27/2008 11:09:08; PackageReference: SOT-523; ComponentHeight: 0.031 inch; PartNumber: MMBT3906T-7-F; Value: MMBT3906T-7-F; ComponentLink1Description: AEO Datasheet Link
R1 R27 = CRCW06032K20JNEA: RES, 2.2 k, 5%, 0.1 W, 0603; Manufacturer: Vishay-Dale; CompType: Resistor; Value: 2.2k; Res_ohm: 2200; Value_Code: 2k20; Tolerance_%: 5; Power_W: 0.1; Value2: 0.1W; VDC_V: 75; TempCo: 200 ppm/C; EIA_Code: E24; U/M: EA; SymbolVersion: 2009-05-29; PartNumber: CRCW06032K20JNEA; PackageReference: 0603; RoHS: Y; Value1: 5%; MountType: SMT; Technology: Thick Film; Published: 2008-06-26; Publisher: Texas Instruments; LatestRevisionDate: 2015-06-13; ComponentLink1Description: Datasheet link; ComponentLink1URL: http://www.vishay.com/docs/20035/dcrcwe3.pdf; Supplier 1: Digi-Key; Supplier Part Number 1: 541-2.2KGCT-ND; Supplier 2: Farnell; Supplier Part Number 2: 1652868; Supplier 3: Newark; Supplier Part Number 3: 59M6776; ValueDisplayed: 2.2k
R2 R3 R11-R14 R28 R29 R42 R45 = RC0603JR-074K7L: RES, 4.7 k, 5%, 0.1 W, 0603; Manufacturer: Yageo America; CompType: Resistor; Value: 4.7k; Res_ohm: 4700; Value_Code: 4k70; Tolerance_%: 5; Power_W: 0.1; Value2: 0.1W; VDC_V: 50; TempCo: 100 ppm/C; EIA_Code: E24; U/M: EA; SymbolVersion: 2009-05-29; PartNumber: RC0603JR-074K7L; PackageReference: 0603; RoHS: Y; Value1: 5%; MountType: SMT; Technology: Thick Film; Published: 2008-06-26; Publisher: Texas Instruments; LatestRevisionDate: 2015-04-17; ComponentLink1Description: Datasheet link; ComponentLink1URL: http://www.yageo.com/pdf/Pu-RC0603_51_PbFree_L_2.pdf; Supplier 1: Digi-Key; Supplier Part Number 1: 311-4.7KGRCT-ND; Supplier 2: Mouser; Supplier Part Number 2: 603-RC0603JR-074K7L; Supplier 3: Farnell; Supplier Part Number 3: 9233466
R4 R6 R33 R35 R36 R43 R44 R49 = CRCW06031K00JNEA: RES, 1.0 k, 5%, 0.1 W, 0603; Manufacturer: Vishay-Dale; CompType: Resistor; Value: 1.0k; Res_ohm: 1000; Value_Code: 1k00; Tolerance_%: 5; Power_W: 0.1; Value2: 0.1W; VDC_V: 75; TempCo: 200 ppm/C; EIA_Code: E24; U/M: EA; SymbolVersion: 2009-05-29; PartNumber: CRCW06031K00JNEA; PackageReference: 0603; RoHS: Y; Value1: 5%; MountType: SMT; Technology: Thick Film; Published: 2008-06-26; Publisher: Texas Instruments; LatestRevisionDate: 2015-04-17; ComponentLink1Description: Datasheet link; ComponentLink1URL: http://www.vishay.com/docs/20035/dcrcwe3.pdf; Supplier 1: Digi-Key; Supplier Part Number 1: 541-1.0KGCT-ND; Supplier 2: Mouser; Supplier Part Number 2: 71-CRCW0603J-1.0K-E3; Supplier 3: Farnell; Supplier Part Number 3: 1652851; ValueDisplayed: 1.0k
R5 = CRCW060310R0JNEA: RES, 10, 5%, 0.1 W, 0603; Manufacturer: Vishay-Dale; CompType: Resistor; Value: 10; Value_Code: 10R0; Tolerance_%: 5; Power_W: 0.1; Value2: 0.1W; VDC_V: 75; TempCo: 200 ppm/C; EIA_Code: E24; U/M: EA; SymbolVersion: 2009-05-29; PartNumber: CRCW060310R0JNEA; PackageReference: 0603; RoHS: Y; Res_ohm: 10; Value1: 5%; MountType: SMT; Technology: Thick Film; Published: 2008-06-26; Publisher: Texas Instruments; LatestRevisionDate: 2015-06-13; ComponentLink1Description: Datasheet link; ComponentLink1URL: http://www.vishay.com/docs/20035/dcrcwe3.pdf; Supplier 1: Digi-Key; Supplier Part Number 1: 541-10GCT-ND; Supplier 2: Mouser; Supplier Part Number 2: 71-CRCW0603J-10-E3; Supplier 3: Farnell; Supplier Part Number 3: 1514712; ValueDisplayed: 10
R7 R22 = CRCW06030000Z0EA: RES, 0, 5%, 0.1 W, 0603; Manufacturer: Vishay-Dale; CompType: Resistor; Res_ohm: 0; Value_Code: 0000; Tolerance_%: 5; Power_W: 0.1; Value2: 0.1W; VDC_V: 75; TempCo: 200 ppm/C; EIA_Code: E24; U/M: EA; SymbolVersion: 2009-05-29; Value: 0Ω; PartNumber: CRCW06030000Z0EA; PackageReference: 0603; RoHS: Y; Value1: 5%; MountType: SMT; Technology: Thick Film; Published: 2008-06-26; Publisher: Texas Instruments; LatestRevisionDate: 2015-05-02; ComponentLink1Description: Datasheet link; ComponentLink1URL: http://www.vishay.com/docs/20035/dcrcwe3.pdf; Supplier 1: Digi-Key; Supplier Part Number 1: 541-0.0GCT-ND; Supplier 2: Mouser; Supplier Part Number 2: 71-CRCW0603-0-E3; Supplier 3: Farnell; Supplier Part Number 3: 1469739; ValueDisplayed: 0
R8 R9 = CRCW25121R00FKEG: RES, 1.00, 1%, 1 W, 2512; Manufacturer: Vishay-Dale; CompType: Resistor; Value: 1.00; Res_ohm: 1; Value_Code: 1R00; Value2: 1W; VDC_V: 500; TempCo: 100 ppm/C; EIA_Code: E96; U/M: EA; SymbolVersion: 2009-05-29; PartNumber: CRCW25121R00FKEG; PackageReference: 2512; RoHS: Y; Tolerance_%: 1; Value1: 1%; Power_W: 1; MountType: SMT; Technology: Thick Film; Published: 2008-06-26; Publisher: Texas Instruments; LatestRevisionDate: 2015-04-21; ComponentLink1Description: Datasheet link; ComponentLink1URL: http://www.vishay.com/doc?20035; Supplier 1: Digi-Key; Supplier Part Number 1: 541-1.00AAFCT-ND; ValueDisplayed: 1.00
R10 R15 = CRCW25122R00FKEG: RES, 2.00, 1%, 1 W, 2512; Manufacturer: Vishay-Dale; CompType: Resistor; Value: 2.00; Res_ohm: 2; Value_Code: 2R00; Tolerance_%: 1; Value2: 1W; VDC_V: 500; TempCo: 100 ppm/C; EIA_Code: E96; U/M: EA; SymbolVersion: 2009-05-29; PartNumber: CRCW25122R00FKEG; PackageReference: 2512; RoHS: Y; Value1: 1%; Power_W: 1; MountType: SMT; Technology: Thick Film; Published: 2008-06-26; Publisher: Texas Instruments; LatestRevisionDate: 2015-04-21; ComponentLink1Description: Datasheet link; ComponentLink1URL: http://www.vishay.com/doc?20035; Supplier 1: Digi-Key; Supplier Part Number 1: 541-2.00AFCT-ND; ValueDisplayed: 2.00
R16-R21 R39 = CRCW060310K0JNEA: RES, 10 k, 5%, 0.1 W, 0603; Manufacturer: Vishay-Dale; CompType: Resistor; Value: 10k; Res_ohm: 10000; Value_Code: 10k0; Tolerance_%: 5; Power_W: 0.1; Value2: 0.1W; VDC_V: 75; TempCo: 200 ppm/C; EIA_Code: E24; U/M: EA; SymbolVersion: 2009-05-29; PartNumber: CRCW060310K0JNEA; PackageReference: 0603; RoHS: Y; Value1: 5%; MountType: SMT; Technology: Thick Film; Published: 2008-06-26; Publisher: Texas Instruments; LatestRevisionDate: 2015-04-17; ComponentLink1Description: Datasheet link; ComponentLink1URL: http://www.vishay.com/docs/20035/dcrcwe3.pdf; Supplier 1: Digi-Key; Supplier Part Number 1: 541-10KGCT-ND; Supplier 2: Mouser; Supplier Part Number 2: 71-CRCW0603J-10K-E3; Supplier 3: Farnell; Supplier Part Number 3: 1469749; ValueDisplayed: 10k
R23 = CRCW0603332KFKEA: RES, 332 k, 1%, 0.1 W, 0603; Manufacturer: Vishay-Dale; CompType: Resistor; Value: 332k; Res_ohm: 332000; Tolerance_%: 1; Power_W: 0.1; Value2: 0.1W; VDC_V: 75; TempCo: 100 ppm/C; EIA_Code: E96; U/M: EA; SymbolVersion: 2009-05-29; PartNumber: CRCW0603332KFKEA; PackageReference: 0603; RoHS: Y; Value_Code: 332k; Value1: 1%; MountType: SMT; Technology: Thick Film; Published: 2008-06-26; Publisher: Texas Instruments; LatestRevisionDate: 2015-04-17; ComponentLink1Description: Datasheet link; ComponentLink1URL: http://www.vishay.com/docs/20035/dcrcwe3.pdf; Supplier 1: Digi-Key; Supplier Part Number 1: 541-332KHCT-ND; Supplier 2: Mouser; Supplier Part Number 2: 71-CRCW0603-332K-E3; Supplier 3: Farnell; Supplier Part Number 3: 1151950; ValueDisplayed: 332k
R24 = CRCW0603390RJNEA: RES, 390, 5%, 0.1 W, 0603; Manufacturer: Vishay-Dale; CompType: Resistor; Value: 390; Value_Code: 390R; Tolerance_%: 5; Power_W: 0.1; Value2: 0.1W; VDC_V: 75; TempCo: 200 ppm/C; EIA_Code: E24; U/M: EA; SymbolVersion: 2009-05-29; PartNumber: CRCW0603390RJNEA; PackageReference: 0603; RoHS: Y; Res_ohm: 390; Value1: 5%; MountType: SMT; Technology: Thick Film; Published: 2008-06-26; Publisher: Texas Instruments; LatestRevisionDate: 2015-06-13; ComponentLink1Description: Datasheet link; ComponentLink1URL: http://www.vishay.com/docs/20035/dcrcwe3.pdf; Supplier 1: Digi-Key; Supplier Part Number 1: 541-390GCT-ND; Supplier 2: Mouser; Supplier Part Number 2: 71-CRCW0603J-390-E3; Supplier 3: Farnell; Supplier Part Number 3: 1739156; ValueDisplayed: 390
R25 = CRCW060315R0JNEA: RES, 15, 5%, 0.1 W, 0603; Manufacturer: Vishay-Dale; CompType: Resistor; Value: 15; Value_Code: 15R0; Tolerance_%: 5; Power_W: 0.1; Value2: 0.1W; VDC_V: 75; TempCo: 200 ppm/C; EIA_Code: E24; U/M: EA; SymbolVersion: 2009-05-29; PartNumber: CRCW060315R0JNEA; PackageReference: 0603; RoHS: Y; Res_ohm: 15; Value1: 5%; MountType: SMT; Technology: Thick Film; Published: 2008-06-26; Publisher: Texas Instruments; LatestRevisionDate: 2015-06-13; ComponentLink1Description: Datasheet link; ComponentLink1URL: http://www.vishay.com/docs/20035/dcrcwe3.pdf; Supplier 1: Digi-Key; Supplier Part Number 1: 541-15GCT-ND; Supplier 2: Mouser; Supplier Part Number 2: 71-CRCW0603J-15-E3; Supplier 3: Farnell; Supplier Part Number 3: 1514720; ValueDisplayed: 15
R26 R48 = CRCW0603100KJNEA: RES, 100 k, 5%, 0.1 W, 0603; Manufacturer: Vishay-Dale; CompType: Resistor; Res_ohm: 100000; Value_Code: 100k; Tolerance_%: 5; Power_W: 0.1; Value2: 0.1W; VDC_V: 75; TempCo: 200 ppm/C; EIA_Code: E24; U/M: EA; SymbolVersion: 2009-05-29; Value: 100KΩ; PartNumber: CRCW0603100KJNEA; PackageReference: 0603; RoHS: Y; Value1: 5%; MountType: SMT; Technology: Thick Film; Published: 2008-06-26; Publisher: Texas Instruments; LatestRevisionDate: 2015-04-06; ComponentLink1Description: Datasheet link; ComponentLink1URL: http://www.vishay.com/docs/20035/dcrcwe3.pdf; Supplier 1: Digi-Key; Supplier Part Number 1: 541-100KGCT-ND; Supplier 2: Mouser; Supplier Part Number 2: 71-CRCW0603J-100K-E3; Supplier 3: Farnell; Supplier Part Number 3: 1692517
R30 = CRCW060310R0FKEAHP: RES, 10.0, 1%, 0.25 W, 0603; Manufacturer: Vishay-Dale; CompType: Resistor; Value: 10.0; Res_ohm: 10; Value_Code: 10R0; Tolerance_%: 1; Power_W: 0.25; Value2: 0.25W; VDC_V: 75; TempCo: 100 ppm/C; EIA_Code: E96; U/M: EA; SymbolVersion: 2009-05-29; PartNumber: CRCW060310R0FKEAHP; PackageReference: 0603; RoHS: Y; Value1: 1%; MountType: SMT; Technology: Thick Film; Published: 2008-06-26; Publisher: Texas Instruments; LatestRevisionDate: 2015-06-13; ComponentLink1Description: Datasheet link; ComponentLink1URL: http://www.vishay.com/docs/20043/crcwhpe3.pdf; Supplier 1: Digi-Key; Supplier Part Number 1: 541-10.0SCT-ND; Supplier 2: Mouser; Supplier Part Number 2: 71-CRCW060310R0FKEAH; ValueDisplayed: 10.0
R31 = CRCW0603330RJNEA: RES, 330, 5%, 0.1 W, 0603; Manufacturer: Vishay-Dale; CompType: Resistor; Value: 330; Value_Code: 330R; Tolerance_%: 5; Power_W: 0.1; Value2: 0.1W; VDC_V: 75; TempCo: 200 ppm/C; EIA_Code: E24; U/M: EA; SymbolVersion: 2009-05-29; PartNumber: CRCW0603330RJNEA; PackageReference: 0603; RoHS: Y; Res_ohm: 330; Value1: 5%; MountType: SMT; Technology: Thick Film; Published: 2008-06-26; Publisher: Texas Instruments; LatestRevisionDate: 2015-04-17; ComponentLink1Description: Datasheet link; ComponentLink1URL: http://www.vishay.com/docs/20035/dcrcwe3.pdf; Supplier 1: Digi-Key; Supplier Part Number 1: 541-330GCT-ND; Supplier 2: Mouser; Supplier Part Number 2: 71-CRCW0603J-330-E3; Supplier 3: Farnell; Supplier Part Number 3: 1692522; ValueDisplayed: 330
R32 = CRCW0603150RJNEA: RES, 150, 5%, 0.1 W, 0603; Manufacturer: Vishay-Dale; CompType: Resistor; Value: 150; Value_Code: 150R; Tolerance_%: 5; Power_W: 0.1; Value2: 0.1W; VDC_V: 75; TempCo: 200 ppm/C; EIA_Code: E24; U/M: EA; SymbolVersion: 2009-05-29; PartNumber: CRCW0603150RJNEA; PackageReference: 0603; RoHS: Y; Res_ohm: 150; Value1: 5%; MountType: SMT; Technology: Thick Film; Published: 2008-06-26; Publisher: Texas Instruments; LatestRevisionDate: 2015-06-13; ComponentLink1Description: Datasheet link; ComponentLink1URL: http://www.vishay.com/docs/20035/dcrcwe3.pdf; Supplier 1: Digi-Key; Supplier Part Number 1: 541-150GCT-ND; Supplier 2: Mouser; Supplier Part Number 2: 71-CRCW0603J-150-E3; Supplier 3: Farnell; Supplier Part Number 3: 1514722; ValueDisplayed: 150
R34 = RC0603JR-072K2L: RES, 2.2 k, 5%, 0.1 W, 0603; Manufacturer: Yageo America; CompType: Resistor; Value: 2.2k; Res_ohm: 2200; Value_Code: 2k20; Tolerance_%: 5; Power_W: 0.1; Value2: 0.1W; VDC_V: 50; TempCo: 100 ppm/C; EIA_Code: E24; U/M: EA; SymbolVersion: 2009-05-29; PartNumber: RC0603JR-072K2L; PackageReference: 0603; RoHS: Y; Value1: 5%; MountType: SMT; Technology: Thick Film; Published: 2008-06-26; Publisher: Texas Instruments; LatestRevisionDate: 2015-04-17; ComponentLink1Description: Datasheet link; ComponentLink1URL: http://www.yageo.com/pdf/Pu-RC0603_51_PbFree_L_2.pdf; Supplier 1: Digi-Key; Supplier Part Number 1: 311-2.2KGRCT-ND; Supplier 2: Mouser; Supplier Part Number 2: 603-RC0603JR-072K2L; Supplier 3: Farnell; Supplier Part Number 3: 9233423
R37 R38 = CRCW06031K80JNEA: RES, 1.8 k, 5%, 0.1 W, 0603; Manufacturer: Vishay-Dale; CompType: Resistor; Value: 1.8k; Res_ohm: 1800; Value_Code: 1k80; Tolerance_%: 5; Power_W: 0.1; Value2: 0.1W; VDC_V: 75; TempCo: 200 ppm/C; EIA_Code: E24; U/M: EA; SymbolVersion: 2009-05-29; PartNumber: CRCW06031K80JNEA; PackageReference: 0603; RoHS: Y; Value1: 5%; MountType: SMT; Technology: Thick Film; Published: 2008-06-26; Publisher: Texas Instruments; LatestRevisionDate: 2015-06-13; ComponentLink1Description: Datasheet link; ComponentLink1URL: http://www.vishay.com/docs/20035/dcrcwe3.pdf; Supplier 1: Digi-Key; Supplier Part Number 1: 541-1.8KGCT-ND; Supplier 2: Mouser; Supplier Part Number 2: 71-CRCW0603J-1.8K-E3; Supplier 3: Farnell; Supplier Part Number 3: 1514705; ValueDisplayed: 1.8k
R40 R41 = RC0603FR-07220KL: RES, 220 k, 1%, 0.1 W, 0603; Manufacturer: Yageo America; CompType: Resistor; Value: 220k; Res_ohm: 220000; Tolerance_%: 1; Power_W: 0.1; Value2: 0.1W; VDC_V: 150; TempCo: 200 ppm/C; U/M: EA; SymbolVersion: 2009-05-29; PartNumber: RC0603FR-07220KL; PackageReference: 0603; RoHS: Y; Value_Code: 220k; Value1: 1%; MountType: SMT; Technology: Thick Film; Published: 2008-06-26; Publisher: Texas Instruments; LatestRevisionDate: 2015-04-17; ComponentLink1Description: Datasheet link; ComponentLink1URL: http://www.yageo.com/pdf/Pu-RC0603_51_PbFree_L_2.pdf; Supplier 1: Digi-Key; Supplier Part Number 1: 311-220KHRCT-ND; Supplier 2: Mouser; Supplier Part Number 2: 603-RC0603FR-07220KL; Supplier 3: Farnell; Supplier Part Number 3: 9238760
R46 = RC0603FR-074K12L: RES, 4.12 k, 1%, 0.1 W, 0603; Manufacturer: Yageo America; CompType: Resistor; Value: 4.12k; Res_ohm: 4120; Value_Code: 4k12; Tolerance_%: 1; Power_W: 0.1; Value2: 0.1W; VDC_V: 150; TempCo: 200 ppm/C; EIA_Code: E96; U/M: EA; SymbolVersion: 2009-05-29; PartNumber: RC0603FR-074K12L; PackageReference: 0603; RoHS: Y; Value1: 1%; MountType: SMT; Technology: Thick Film; Published: 2008-06-26; Publisher: Texas Instruments; LatestRevisionDate: 2015-04-17; ComponentLink1Description: Datasheet link; ComponentLink1URL: http://www.yageo.com/pdf/Pu-RC0603_51_PbFree_L_2.pdf; Supplier 1: Digi-Key; Supplier Part Number 1: 311-4.12KHRCT-ND; Supplier 2: Mouser; Supplier Part Number 2: 603-RC0603FR-074K12L; Supplier 3: Farnell; Supplier Part Number 3: 9238565
R47 = RC0603FR-079K76L: RES, 9.76 k, 1%, 0.1 W, 0603; Manufacturer: Yageo America; CompType: Resistor; Value: 9.76k; Res_ohm: 9760; Value_Code: 9k76; Tolerance_%: 1; Power_W: 0.1; Value2: 0.1W; VDC_V: 150; TempCo: 200 ppm/C; EIA_Code: E96; U/M: EA; SymbolVersion: 2009-05-29; PartNumber: RC0603FR-079K76L; PackageReference: 0603; RoHS: Y; Value1: 1%; MountType: SMT; Technology: Thick Film; Published: 2008-06-26; Publisher: Texas Instruments; LatestRevisionDate: 2015-04-17; ComponentLink1Description: Datasheet link; ComponentLink1URL: http://www.yageo.com/pdf/Pu-RC0603_51_PbFree_L_2.pdf; Supplier 1: Digi-Key; Supplier Part Number 1: 311-9.76KHRCT-ND; Supplier 2: Mouser; Supplier Part Number 2: 603-RC0603FR-079K76L
R50-R52 = RC0603JR-0715KL: RES, 15 k, 5%, 0.1 W, 0603; Manufacturer: Yageo America; CompType: Resistor; Value: 15k; Res_ohm: 15000; Value_Code: 15k0; Tolerance_%: 5; Power_W: 0.1; Value2: 0.1W; VDC_V: 50; TempCo: 100 ppm/C; EIA_Code: E24; U/M: EA; SymbolVersion: 2009-05-29; PartNumber: RC0603JR-0715KL; PackageReference: 0603; RoHS: Y; Value1: 5%; MountType: SMT; Technology: Thick Film; Published: 2008-06-26; Publisher: Texas Instruments; LatestRevisionDate: 2015-04-17; ComponentLink1Description: Datasheet link; ComponentLink1URL: http://www.yageo.com/pdf/Pu-RC0603_51_PbFree_L_2.pdf; Supplier 1: Digi-Key; Supplier Part Number 1: 311-15KGRCT-ND; Supplier 2: Mouser; Supplier Part Number 2: 603-RC0603JR-0715KL; Supplier 3: Farnell; Supplier Part Number 3: 9233520
TP1-TP5 = 5000: Test Point, Miniature, Red, TH; Manufacturer: Keystone; CompType: Test Point Loop; U/M: EA; SymbolVersion: 2008-04-04; PartNumber: 5000; Value: Red; PackageReference: Red Miniature Testpoint; RoHS: Y; MountType: TH; ComponentLink1Description: Datasheet Link; ComponentLink1URL: http://www.keyelco.com/userAssets/file/M60-2p60.pdf; Publisher: Texas Instruments; LatestRevisionDate: 2014-11-22; Supplier 1: Digi-Key; Supplier Part Number 1: 5000K-ND
U1 = ISO7842DWR: High-Performance, 8000 VPK Reinforced Quad Channel Digital Isolator, DW0016B; Manufacturer: Texas Instruments; SymbolCreator: Altium; CompType: IC; U/M: EA; SymbolVerison: 2014-12-19; PartNumber: ISO7842DWR; Alternate PartNumber: ISO7842DW; PackageReference: DW0016B; MountType: SMT; ComponentLink1Description: Datasheet Link; ComponentLink1URL: http://www.ti.com/lit/ds/symlink/iso7842.pdf; RoHS: Y; Publisher: Texas Instruments; LatestRevisionDate: 2015-04-24; Alternate Manufacturer: Texas Instruments
U2 = SN74LVC1G125DCK: IC, Single Bus Buffer Gate With 3-States Outputs, OE  Active Low; Manufacturer: TI; Alternate Manufacturer: None; Area: 19,500; ComponentLink1URL: \\vette02\pmp_pcb\pcad_pdf's\sn74lvc1g125.pdf; SymbolVersion: 02/17/2009 08:57:26; PackageReference: DCK; ComponentHeight: 0.043; PartNumber: SN74LVC1G125DCK; Value: SN74LVC1G125DCK; ComponentLink1Description: AEO Datasheet Link
U3 = TPS51604DSG: Synchronous Buck FET Driver Optimized for High-Frequency Applications, DSG0008A; Manufacturer: Texas Instruments; SymbolCreator: a0411947; CompType: IC; U/M: EA; SymbolVersion: 2013-03-22; PartNumber: TPS51604DSG; PackageReference: DSG0008A; MountType: SMT; ComponentLink1Description: Datasheet Link; ComponentLink1URL: http://www.ti.com/lit/ds/symlink/tps51604.pdf; RoHS: Y; Publisher: Texas Instruments; LatestRevisionDate: 2015-02-18; Alternate Manufacturer: Texas Instruments
U4 = TPS7A4201DGNT: Single Output LDO, 50 mA, Adjustable 1.175 to 26 V Output, 7 to 28 V Input, 8-pin MSOP (DGN), -40 to 125 degC, Green (RoHS & no Sb/Br); Manufacturer: Texas Instruments; Alternate Manufacturer: None; Alternate PartNumber: Equivalent; Accuracy(%): 1; Iout(Max)(A): 0.05; Iq(Typ)(mA): 0.02; SubFamily: Single Channel LDO; Vdo(Typ)(mV): 290; Vin(Max)(V): 28; Vin(Min)(V): 7; Vout Adj(Max)(V): 26; Vout Adj(Min)(V): 1.161; DatasheetVersion: SBVS184; PackageVersion: 4073271/F; PackageReference: DGN0008B; PackageDescription: 8-Pin Plastic Small Outline, Body 3 x 3 mm, Pitch 0.65 mm; Supplier 1: Digi-Key; Supplier Part Number 1: 296-30185-2-ND; Supplier 2: Digi-Key; Supplier Part Number 2: 296-30185-1-ND; Supplier 3: Digi-Key; Supplier Part Number 3: 296-30185-6-ND; Supplier 4: Farnell; Supplier Part Number 4: 2078551; Supplier 5: Newark; Supplier Part Number 5: 82T9741; Supplier 6: Newark; Supplier Part Number 6: 76T8167; Supplier 7: Mouser; Supplier Part Number 7: 595-TPS7A4201DGNT; Eco-Plan: Green (RoHS & no Sb/Br); MountType: SMT; Code_JEDEC: MO-187; PartNumber: TPS7A4201DGNT; ComponentLink1Description: Manufacturer URL; ComponentLink1URL: http://www.ti.com/; ComponentLink2Description: Datasheet; ComponentLink2URL: http://www.ti.com/general/docs/lit/getliterature.tsp?genericPartNumber=TPS7A4201&fileType=pdf; ComponentLink3Description: Package Specification; ComponentLink3URL: http://www.ti.com/litv/pdf/mpds046e
U5 = TLV3201DBV: 40-ns, microPOWER, Push-Pull Output Comparators, DBV0005A; Manufacturer: Texas Instruments; CompType: IC; U/M: EA; SymbolVersion: 2008-11-25; PartNumber: TLV3201DBV; PackageReference: DBV0005A; MountType: SMT; ComponentLink1Description: Datasheet Link; ComponentLink1URL: http://www.ti.com/lit/ds/symlink/tlv3201.pdf; RoHS: Y; Publisher: Texas Instruments; LatestRevisionDate: 2015-04-24; Alternate Manufacturer: Texas Instruments
U6 = TPS3700DDC: IC,  High Voltage, Over-Under Voltage Supervisory; Manufacturer: TI; Alternate Manufacturer: None; Area: 23200; ComponentLink1URL: \\vette02\pmp_pcb\pcad_pdf's\; SymbolVersion: 02/06/2012 14:38:27; PackageReference: SOT-23; PartNumber: TPS3700DDC; Value: TPS3700DDC; ComponentLink1Description: AEO Datasheet Link